# Altium schematic sheet Relay PCB.SchDoc
size A4
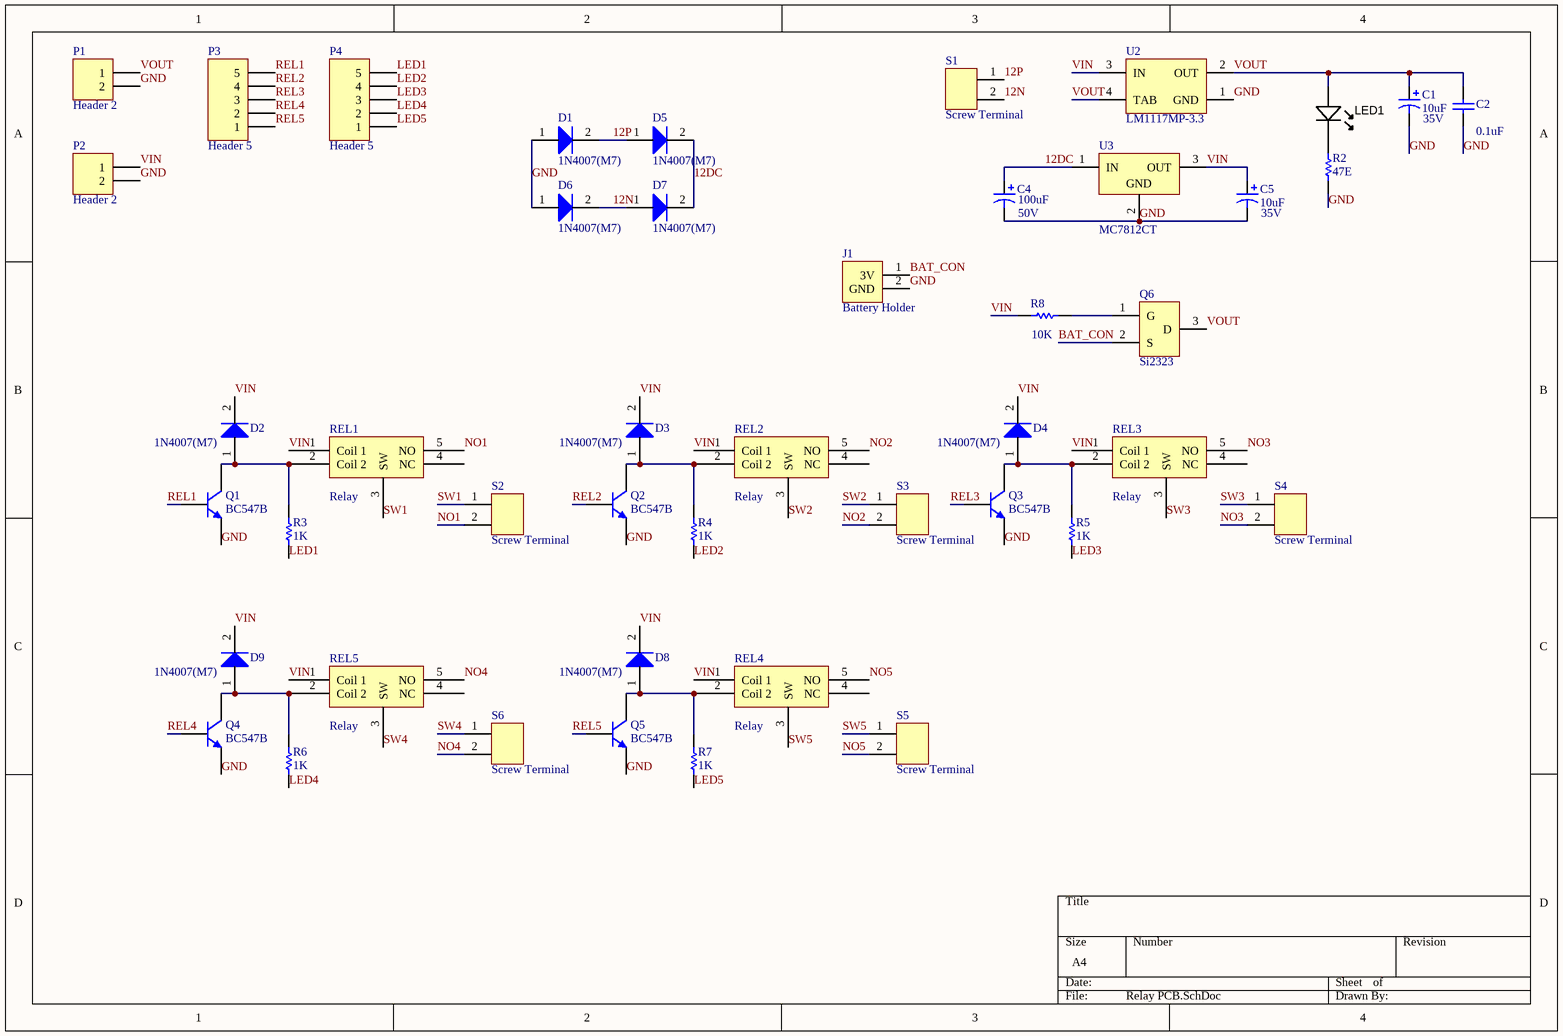
[diagram p0: Relay PCB.SchDoc]

## Parts
C1  Voltage: 35V  [B]  (hidden comment: 10uF)
C2  0.1uF  [0805]
C4  value 100uF  Voltage: 50V  [CAPPR2-5x6.8]  (hidden comment: 10uF)
C5  Voltage: 35V  [B]  (hidden comment: 10uF)
D1  1N4007(M7)  [1N4007 (M7)]
D2  1N4007(M7)  [1N4007 (M7)]
D3  1N4007(M7)  [1N4007 (M7)]
D4  1N4007(M7)  [1N4007 (M7)]
D5  1N4007(M7)  [1N4007 (M7)]
D6  1N4007(M7)  [1N4007 (M7)]
D7  1N4007(M7)  [1N4007 (M7)]
D8  1N4007(M7)  [1N4007 (M7)]
D9  1N4007(M7)  [1N4007 (M7)]
J1  Battery Holder  [Battery Holder]
LED1  (no value)  [LED-0805-K]
P1  Header 2  [HDR1X2]
P2  Header 2  [HDR1X2]
P3  Header 5  [HDR1X5]
P4  Header 5  [HDR1X5]
Q1  BC547B  [29-04]
Q2  BC547B  [29-04]
Q3  BC547B  [29-04]
Q4  BC547B  [29-04]
Q5  BC547B  [29-04]
Q6  Si2323  [Si2323 PMOS]
R2  47E  [ERA-0805]
R3  1K  [ERA-0805]
R4  1K  [ERA-0805]
R5  1K  [ERA-0805]
R6  1K  [ERA-0805]
R7  1K  [ERA-0805]
R8  10K  [ERA-0805]
REL1  Relay  [Relay]
REL2  Relay  [Relay]
REL3  Relay  [Relay]
REL4  Relay  [Relay]
REL5  Relay  [Relay]
S1  Screw Terminal  [Screw Terminal]
S2  Screw Terminal  [Screw Terminal]
S3  Screw Terminal  [Screw Terminal]
S4  Screw Terminal  [Screw Terminal]
S5  Screw Terminal  [Screw Terminal]
S6  Screw Terminal  [Screw Terminal]
U2  LM1117MP-3.3  [MP04A_N]
U3  MC7812CT  [221A-04]

## Nets
12DC: C4.1 D5.2(K) D7.2(K) U3.1(IN)
12N: D6.2(K) D7.1(A) S1.2
12P: D1.2(K) D5.1(A) S1.1
BAT_CON: J1.1(3V) Q6.2(S)
GND: C1.2 C2.1 C4.2 C5.2 D1.1(A) D6.1(A) J1.2(GND) P1.2 P2.2 Q1.3(E) Q2.3(E) Q3.3(E) Q4.3(E) Q5.3(E) R2.2 U2.1(GND) U3.2(GND)
LED1: P4.5 R3.1
LED2: P4.4 R4.1
LED3: P4.3 R5.1
LED4: P4.2 R6.1
LED5: P4.1 R7.1
NO1: REL1.5(NO) S2.2
NO2: REL2.5(NO) S3.2
NO3: REL3.5(NO) S4.2
NO4: REL5.5(NO) S6.2
NO5: REL4.5(NO) S5.2
REL1: P3.5 Q1.2(B)
REL2: P3.4 Q2.2(B)
REL3: P3.3 Q3.2(B)
REL4: P3.2 Q4.2(B)
REL5: P3.1 Q5.2(B)
SW1: REL1.3(SW) S2.1
SW2: REL2.3(SW) S3.1
SW3: REL3.3(SW) S4.1
SW4: REL5.3(SW) S6.1
SW5: REL4.3(SW) S5.1
VIN: C5.1 D2.2(K) D3.2(K) D4.2(K) D8.2(K) D9.2(K) P2.1 R8.1 REL1.1(Coil_1) REL2.1(Coil_1) REL3.1(Coil_1) REL4.1(Coil_1) REL5.1(Coil_1) U2.3(IN) U3.3(OUT)
VOUT: C1.1 C2.2 LED1.A P1.1 Q6.3(D) U2.2(OUT) U2.4(TAB)
NetD2_1: D2.1(A) Q1.1(C) R3.2 REL1.2(Coil_2)
NetD3_1: D3.1(A) Q2.1(C) R4.2 REL2.2(Coil_2)
NetD4_1: D4.1(A) Q3.1(C) R5.2 REL3.2(Coil_2)
NetD8_1: D8.1(A) Q5.1(C) R7.2 REL4.2(Coil_2)
NetD9_1: D9.1(A) Q4.1(C) R6.2 REL5.2(Coil_2)
NetLED1_K: LED1.K R2.1
NetQ6_1: Q6.1(G) R8.2

Not connected (* = marked no-connect by the designer): REL1 4(NC); REL2 4(NC); REL3 4(NC); REL4 4(NC); REL5 4(NC)

## Library data of the parts
C1 C5 = T491B: Solid Tantalum Chip Capacitor, Standard T491 Series - Industrial Grade; Published: 17-Jul-2002; LatestRevisionDate: 19-Mar-2004; LatestRevisionNote: Silkscreen dimensions re-sized.; DatasheetDocument: Mar-2001; PackageDocument: Mar-2001; PackageReference: B; Publisher: Altium Limited; Code_JEITA: 3528-21; ComponentLink1Description: Manufacturer Link; ComponentLink1URL: http://www.kemet.com/; ComponentLink2Description: Datasheet; ComponentLink2URL: http://www.kemet.com/kemet/web/homepage/kechome.nsf/vapubfilesname/F3102TA.pdf/$file/F3102TA.pdf; Value: 10uF
C2 = C0805: Ceramic Chip Capacitor - Standard; Note: Footprint corresponds to dimensions for bulk cassette packaging. This case size has tightened tolerances.; Published: 17-Jul-2002; LatestRevisionDate: 19-Mar-2004; LatestRevisionNote: Silkscreen size reduced.; DatasheetDocument: Mar-2001; PackageDocument: Mar-2001; PackageReference: 0805; Publisher: Altium Limited; Code_JEITA: 0805; Code_IPC: 2012[0805]; ComponentLink1Description: Manufacturer Link; ComponentLink1URL: http://www.kemet.com/; ComponentLink2Description: Datasheet; ComponentLink2URL: http://www.kemet.com/kemet/web/homepage/kechome.nsf/vapubfilesname/F3102TA.pdf/$file/F3102TA.pdf; Value: 0.1uF
C4 = Cap Pol1: Polarized Capacitor (Radial); Published: 8-Jun-2000; LatestRevisionDate: 17-Jul-2002; LatestRevisionNote: Re-released for DXP Platform.; PackageReference: RB7.6-15; Publisher: Altium Limited
LED1 = LED_SMD_Green_0805_6mcd: LED, 0805 SMD, Green; Manufacturer 1: LITE-ON; Manufacturer Part Number 1: LTST-C171GKT; Material: GaP; Ratings: 6 mcd; 569 nm; SCDType: source; Package / Case: 0805; Supplier 1: Digi-Key; Supplier Part Number 1: 160-1423-1-ND
P1 P2 = Header 2: Header, 2-Pin; LatestRevisionDate: 17-Jul-2002; LatestRevisionNote: Re-released for DXP Platform.; Publisher: Altium Limited
P3 P4 = Header 5: Header, 5-Pin; LatestRevisionDate: 17-Jul-2002; LatestRevisionNote: Re-released for DXP Platform.; Publisher: Altium Limited
Q1-Q5 = BC547B: Amplifier Transistor NPN Silicon; Published: 29-Sep-2000; LatestRevisionDate: 17-Jul-2002; LatestRevisionNote: Re-released for DXP Platform.; DatasheetVersion: 1991; PackageVersion: 1996; PackageReference: 29-04; Publisher: Altium Limited; PackageDescription: TO, Flat Index; 3 In-Line, Axial Leads; Body Dia. 4.8mm; Leads 0.48 x 0.5 mm (max); ComponentLink1Description: Manufacturer Link; ComponentLink1URL: http://www.onsemi.com/site/products/landing?taxonomyID=194; ComponentLink2Description: Datasheet; ComponentLink2URL: http://www.onsemi.com/pub/Collateral/BC546-D.PDF
R2-R8 = ERA6Y: Rectangular Thick Film Chip Resistor, 10 Ohm to 1M Ohm Range, 0.1% and 0.5% Tolerance, 0805 Size, 0.1 W; Note: If flow soldering, adjust pad width of PCB Footprint to 0.7 - 0.8 times the width of the resistor.; Published: 17-Dec-2003; LatestRevisionDate: 19-Mar-2004; LatestRevisionNote: Silkscreen size reduced.; PackageDocument: Mar-2003; PackageReference: ERA-0805; Publisher: Altium Limited; Code_IPC: 2012 [0805]; ComponentLink1Description: Manufacturer Link; ComponentLink1URL: http://www.panasonic.com/industrial/components/resistive_products.htm; ComponentLink2Description: Datasheet; ComponentLink2URL: http://www.panasonic.com/industrial/components/pdf/AOA0000CE8.pdf
  R2: Value: 47E
  R3-R7: Value: 1K
  R8: Value: 10K
U2 = LM1117MP-3.3: 800mA Low-Dropout Linear Regulator; Manufacturer: National Semiconductor; CompType: LDO IC; PackageTopMarking: XYTT*N05A; PowerWise: N; Published: 4-Dec-2008; DatasheetVersion: Apr-2006; PackageVersion: revB, Apr-2003; PackageReference: MP04A; Publisher: Altium Limited; PackageDescription: Molded SOT-223, 6.50 x 3.56 x 1.6mm Body, 4 Lead, 2.3mm Pitch; PartNumber: LM1117MP-3.3; RoHS: O; PinCount: 4; DigiKeyPartNumber: LM1117MP-3.3CT-ND; Code_JEDEC: TO-261-AA; Code_IPC: SOT223-4; ComponentLink1Description: LM1117 Datasheet; ComponentLink1URL: http://www.national.com/ds/LM/LM1117.pdf; ComponentLink2Description: LM1117 Web Page; ComponentLink2URL: http://www.national.com/pf/LM/LM1117.html; ComponentLink3Description: MP04A Package Page; ComponentLink3URL: http://www.national.com/packaging/folders/mp04a.html
U3 = MC7812CT: 3-Terminal Positive Fixed Voltage Regulator; Note: Pin 2 is electrically connected to TAB; Published: 17-Jul-2002; DatasheetVersion: 1988; PackageReference: 221A-04; Publisher: Altium Limited; PackageDescription: TO, Thru-Hole, Vertical, Heatsink Mounted; 3 In-Line Leads; Pitch 2.54 mm; Code_JEDEC: TO-262-AA; ComponentLink1Description: Manufacturer Link; ComponentLink1URL: http://www.onsemi.com/site/products/taxonomy/0,4438,503,00.html; ComponentLink2Description: Datasheet; ComponentLink2URL: http://www.onsemi.com/pub/Collateral/MC7800-D.PDF